# Altium schematic sheet microcontroller.SchDoc: Microcontroller, Indicator, and RX
size Letter; Organization: PulseOut COVID; Address1: By: C. Miller; Address2: pulseoutcovid.com; DocumentNumber: 1; Revision: 0; SheetNumber: 2; SheetTotal: 5
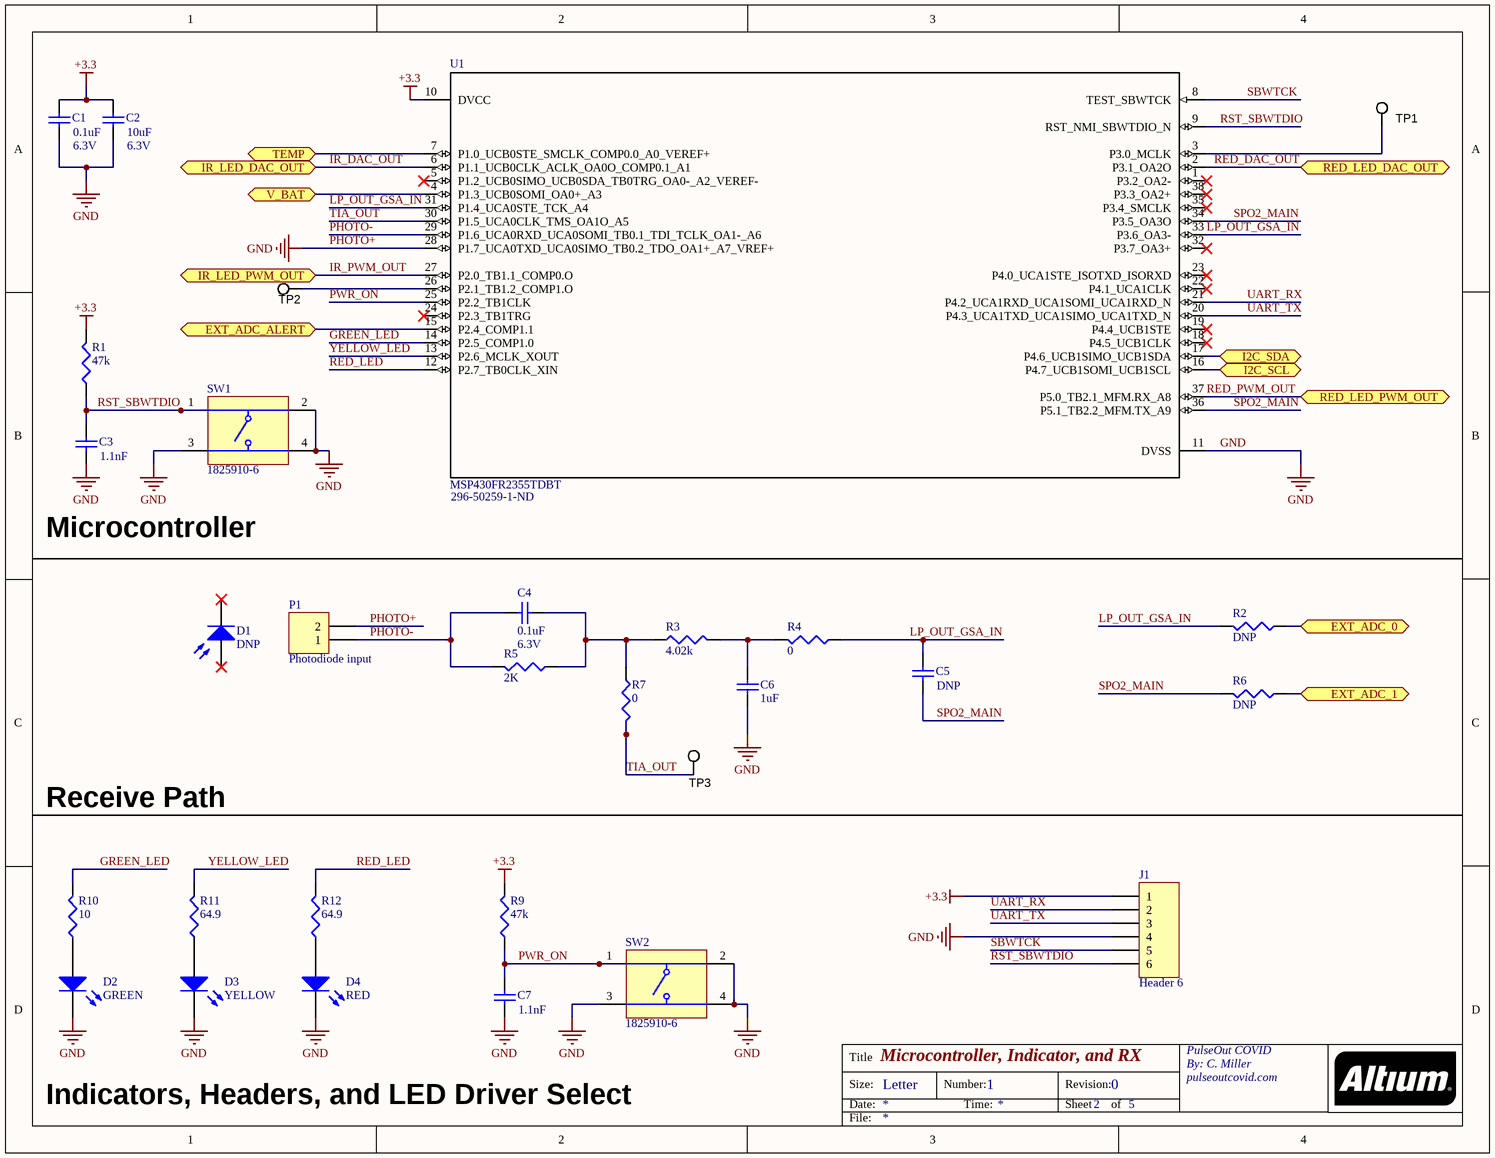
[diagram p0: microcontroller.SchDoc]

## Parts
C1  value 0.1uF  Voltage: 6.3V  [1608[0603]]  (hidden comment: Cap Semi)
C2  value 10uF  Voltage: 6.3V  [1608[0603]]  (hidden comment: Cap Semi)
C3  value 1.1nF  [0603]  (hidden comment: Cap Semi)
C4  value 0.1uF  Voltage: 6.3V  [1608[0603]]  (hidden comment: Cap Semi)
C5  value DNP  [0603]  (hidden comment: Cap Semi)
C6  value 1uF  [1608[0603]]  (hidden comment: Cap Semi)
C7  value 1.1nF  [0603]  (hidden comment: Cap Semi)
D1  DNP  [PIN2]
D2  GREEN  [3.5X2.8X1.9]
D3  YELLOW  [3.5X2.8X1.9]
D4  RED  [3.5X2.8X1.9]
J1  Header 6  [HDR1X6]
P1  Photodiode input  [HDR1X2]
R1  value 47k  [J1-0603]  (hidden comment: Res3)
R2  value DNP  [J1-0603]  (hidden comment: Res3)
R3  value 4.02k  [J1-0603]  (hidden comment: Res3)
R4  value 0  [J1-0603]  (hidden comment: Res3)
R5  value 2K  [J1-0603]  (hidden comment: Res3)
R6  value DNP  [J1-0603]  (hidden comment: Res3)
R7  value 0  [J1-0603]  (hidden comment: Res3)
R9  value 47k  [J1-0603]  (hidden comment: Res3)
R10  value 10  [J1-0603]  (hidden comment: Res3)
R11  value 64.9  [J1-0603]  (hidden comment: Res3)
R12  value 64.9  [J1-0603]  (hidden comment: Res3)
SW1  1825910-6  [TECO-1825910-6_V]
SW2  1825910-6  [TECO-1825910-6_V]
TP1  5002  [Keystone5002]  (value not drawn)
TP2  5002  [Keystone5002]  (value not drawn)
TP3  5002  [Keystone5002]  (value not drawn)
U1  MSP430FR2355TDBT  DigiKey: 296-50259-1-ND  [DBT0038A_N]

## Ports
EXT_ADC_0 (bidir), EXT_ADC_1 (bidir), EXT_ADC_ALERT (bidir), I2C_SCL (bidir), I2C_SDA (bidir), IR_LED_DAC_OUT (bidir), IR_LED_PWM_OUT (bidir), RED_LED_DAC_OUT (bidir), RED_LED_PWM_OUT (bidir), TEMP (bidir), V_BAT (bidir)

## Nets
+3.3: C1.2 C2.2 J1.1 R1.2 R9.2 U1.10(DVCC)
GND: C1.1 C2.1 C3.1 C6.2 C7.1 D2.2(K) D3.2(K) D4.2(K) J1.4 P1.2 SW1.2 SW1.3 SW1.4 SW2.2 SW2.3 SW2.4 U1.11(DVSS) U1.28(P1.7_UCA0TXD_UCA0SIMO_TB0.2_TDO_OA1+_A7_VREF+)  [also labelled PHOTO+]
EXT_ADC_0: R2.1 ; port EXT_ADC_0
EXT_ADC_1: R6.1 ; port EXT_ADC_1
EXT_ADC_ALERT: U1.15(P2.4_COMP1.1) ; port EXT_ADC_ALERT
GREEN_LED: R10.2 U1.14(P2.5_COMP1.0)
I2C_SCL: U1.16(P4.7_UCB1SOMI_UCB1SCL) ; port I2C_SCL
I2C_SDA: U1.17(P4.6_UCB1SIMO_UCB1SDA) ; port I2C_SDA
IR_DAC_OUT: U1.6(P1.1_UCB0CLK_ACLK_OA0O_COMP0.1_A1) ; port IR_LED_DAC_OUT
IR_PWM_OUT: U1.27(P2.0_TB1.1_COMP0.O) ; port IR_LED_PWM_OUT
LP_OUT_GSA_IN: C5.2 R2.2 R4.1 U1.31(P1.4_UCA0STE_TCK_A4) U1.33(P3.6_OA3-)
PHOTO-: C4.2 P1.1 R5.2 U1.29(P1.6_UCA0RXD_UCA0SOMI_TB0.1_TDI_TCLK_OA1-_A6)
PWR_ON: C7.2 R9.1 SW2.1 U1.25(P2.2_TB1CLK)
RED_DAC_OUT: U1.2(P3.1_OA2O) ; port RED_LED_DAC_OUT
RED_LED: R12.2 U1.12(P2.7_TB0CLK_XIN)
RED_PWM_OUT: U1.37(P5.0_TB2.1_MFM.RX_A8) ; port RED_LED_PWM_OUT
RST_SBWTDIO: C3.2 J1.6 R1.1 SW1.1 U1.9(RST_NMI_SBWTDIO_N)
SBWTCK: J1.5 U1.8(TEST_SBWTCK)
SPO2_MAIN: C5.1 R6.2 U1.34(P3.5_OA3O) U1.36(P5.1_TB2.2_MFM.TX_A9)
TEMP: U1.7(P1.0_UCB0STE_SMCLK_COMP0.0_A0_VEREF+) ; port TEMP
TIA_OUT: R7.2 TP3.1 U1.30(P1.5_UCA0CLK_TMS_OA1O_A5)
UART_RX: J1.2 U1.21(P4.2_UCA1RXD_UCA1SOMI_UCA1RXD_N)
UART_TX: J1.3 U1.20(P4.3_UCA1TXD_UCA1SIMO_UCA1TXD_N)
V_BAT: U1.4(P1.3_UCB0SOMI_OA0+_A3) ; port V_BAT
YELLOW_LED: R11.2 U1.13(P2.6_MCLK_XOUT)
NetC4_1: C4.1 R3.1 R5.1 R7.1
NetC6_1: C6.1 R3.2 R4.2
NetD2_1: D2.1(A) R10.1
NetD3_1: D3.1(A) R11.1
NetD4_1: D4.1(A) R12.1
NetTP1_1: TP1.1 U1.3(P3.0_MCLK)
NetTP2_1: TP2.1 U1.26(P2.1_TB1.2_COMP1.O)

Not connected (* = marked no-connect by the designer): D1 1(A)* 2(K)*; U1 1(P3.2_OA2-)* 5(P1.2_UCB0SIMO_UCB0SDA_TB0TRG_OA0-_A2_VEREF-)* 18(P4.5_UCB1CLK)* 19(P4.4_UCB1STE)* 22(P4.1_UCA1CLK)* 23(P4.0_UCA1STE_ISOTXD_ISORXD)* 24(P2.3_TB1TRG)* 32(P3.7_OA3+)* 35(P3.4_SMCLK)* 38(P3.3_OA2+)*

## Notes on the sheet
- Microcontroller
- Receive Path
- Indicators, Headers, and LED Driver Select
- Title
- Size:
- Date:
- Letter
- Number:
- Time:
- Revision:
- Sheet
- of
- File:

## Library data of the parts
C1 C4 = Cap Semi: Capacitor (Semiconductor SIM Model); MPN: 06036C104KAT4A; Manufacturer: AVX Corporation; Published: 8-Jun-2000; LatestRevisionDate: 29-May-2009; LatestRevisionNote: IPC-7351 Footprint Added.; PackageReference: C1206; Publisher: Altium Limited; PackageDescription: Chip Capacitor; DigiKey: 478-06036C104KAT4ACT-ND
C2 = Cap Semi: Capacitor (Semiconductor SIM Model); MPN: JMK107ABJ106KA-T; Manufacturer: Taiyo Yuden; Published: 8-Jun-2000; LatestRevisionDate: 29-May-2009; LatestRevisionNote: IPC-7351 Footprint Added.; PackageReference: C1206; Publisher: Altium Limited; PackageDescription: Chip Capacitor; DigiKey: 587-6012-1-ND
C3 C7 = Cap Semi: Capacitor (Semiconductor SIM Model); MPN: GRM1885C1H112JA01D; Manufacturer: Murata Electronics; Published: 8-Jun-2000; LatestRevisionDate: 29-May-2009; LatestRevisionNote: IPC-7351 Footprint Added.; PackageReference: C1206; Publisher: Altium Limited; PackageDescription: Chip Capacitor; DigiKey: 490-1452-1-ND
C5 = Cap Semi: Capacitor (Semiconductor SIM Model); Published: 8-Jun-2000; LatestRevisionDate: 29-May-2009; LatestRevisionNote: IPC-7351 Footprint Added.; PackageReference: C1206; Publisher: Altium Limited; PackageDescription: Chip Capacitor; DigiKey: DNP
C6 = Cap Semi: Capacitor (Semiconductor SIM Model); MPN: C0603X105J9RAC7867; Manufacturer: KEMET; Published: 8-Jun-2000; LatestRevisionDate: 29-May-2009; LatestRevisionNote: IPC-7351 Footprint Added.; PackageReference: C1206; Publisher: Altium Limited; PackageDescription: Chip Capacitor; DigiKey: 399-17700-1-ND
D1 = Photo Sen: Photosensitive Diode; MPN: BPW34; Manufacturer: OSRAM Opto Semiconductors Inc.; Published: 24-Mar-1999; LatestRevisionDate: 17-Jul-2002; LatestRevisionNote: Re-released for DXP Platform.; PackageReference: PIN2; Publisher: Altium Limited; DigiKey: 475-1070-ND
D2 = LED3: Typical BLUE SiC LED; MPN: 150141GS73100; Manufacturer: Wurth Elektronik; Published: 8-Jun-2000; LatestRevisionDate: 17-Dec-2003; LatestRevisionNote: PCB Footprint replaced.; DatasheetVersion: 16-Apr-2002; PackageVersion: 16-Apr-2002; PackageReference: 3.5X2.8X1.9; Publisher: Altium Limited; PackageDescription: SM LED; 2 C-Bend Leads; Body 3.5 x 2.8 x 1.9 mm, inc leads (LxWxH typ); DigiKey: 732-4997-1-ND
D3 = LED3: Typical BLUE SiC LED; MPN: SML-Z14YTT86C; Manufacturer: Rohm Semiconductor; Published: 8-Jun-2000; LatestRevisionDate: 17-Dec-2003; LatestRevisionNote: PCB Footprint replaced.; DatasheetVersion: 16-Apr-2002; PackageVersion: 16-Apr-2002; PackageReference: 3.5X2.8X1.9; Publisher: Altium Limited; PackageDescription: SM LED; 2 C-Bend Leads; Body 3.5 x 2.8 x 1.9 mm, inc leads (LxWxH typ); DigiKey: SML-Z14YTT86CCT-ND
D4 = LED3: Typical BLUE SiC LED; MPN: 150141RS73100; Manufacturer: Wurth Elektronik; Published: 8-Jun-2000; LatestRevisionDate: 17-Dec-2003; LatestRevisionNote: PCB Footprint replaced.; DatasheetVersion: 16-Apr-2002; PackageVersion: 16-Apr-2002; PackageReference: 3.5X2.8X1.9; Publisher: Altium Limited; PackageDescription: SM LED; 2 C-Bend Leads; Body 3.5 x 2.8 x 1.9 mm, inc leads (LxWxH typ); DigiKey: 732-5000-1-ND
J1 = Header 6: Header, 6-Pin; MPN: 800-10-006-10-001000; Manufacturer: Mill-Max Manufacturing; LatestRevisionDate: 17-Jul-2002; LatestRevisionNote: Re-released for DXP Platform.; Publisher: Altium Limited; DigiKey: ED7264-06-ND
P1 = Header 2: Header, 2-Pin; LatestRevisionDate: 17-Jul-2002; LatestRevisionNote: Re-released for DXP Platform.; Publisher: Altium Limited
R1 R9 = Res3: Resistor; MPN: RC0603JR-0747KL; Manufacturer: Yageo; Published: 8-Jun-2000; LatestRevisionDate: 29-May-2009; LatestRevisionNote: IPC-7351 Footprint Added.; PackageReference: J1-0603; Publisher: Altium Limited; PackageDescription: Chip Resistor; DigiKey: 311-47KGRCT-ND
R2 R6 = Res3: Resistor; Published: 8-Jun-2000; LatestRevisionDate: 29-May-2009; LatestRevisionNote: IPC-7351 Footprint Added.; PackageReference: J1-0603; Publisher: Altium Limited; PackageDescription: Chip Resistor; DigiKey: DNP
R3 = Res3: Resistor; MPN: RMCF0603FT4K02; Manufacturer: Stackpole Electronics; Published: 8-Jun-2000; LatestRevisionDate: 29-May-2009; LatestRevisionNote: IPC-7351 Footprint Added.; PackageReference: J1-0603; Publisher: Altium Limited; PackageDescription: Chip Resistor; DigiKey: RMCF0603FT4K02CT-ND
R4 R7 = Res3: Resistor; MPN: RC0603JR-070RL; Manufacturer: Yageo; Published: 8-Jun-2000; LatestRevisionDate: 29-May-2009; LatestRevisionNote: IPC-7351 Footprint Added.; PackageReference: J1-0603; Publisher: Altium Limited; PackageDescription: Chip Resistor; DigiKey: 311-0.0GRCT-ND
R5 = Res3: Resistor; MPN: RC0603FR-072KL; Manufacturer: Yageo; Published: 8-Jun-2000; LatestRevisionDate: 29-May-2009; LatestRevisionNote: IPC-7351 Footprint Added.; PackageReference: J1-0603; Publisher: Altium Limited; PackageDescription: Chip Resistor; DigiKey: 311-2.00KHRCT-ND
R10 = Res3: Resistor; MPN: RC0603FR-0710RL; Manufacturer: Yageo; Published: 8-Jun-2000; LatestRevisionDate: 29-May-2009; LatestRevisionNote: IPC-7351 Footprint Added.; PackageReference: J1-0603; Publisher: Altium Limited; PackageDescription: Chip Resistor; DigiKey: 311-10.0HRCT-ND
R11 R12 = Res3: Resistor; MPN: ERA-3AEB64R9V; Manufacturer: Panasonic; Published: 8-Jun-2000; LatestRevisionDate: 29-May-2009; LatestRevisionNote: IPC-7351 Footprint Added.; PackageReference: J1-0603; Publisher: Altium Limited; PackageDescription: Chip Resistor; DigiKey: P64.9DBCT-ND
SW1 SW2 = CMP-1684-00021-1: Tact Switch, SPST-NO, 0.05 A, -35 to 85 degC, 4-Pin THD, RoHS, Bulk; Manufacturer: TE Connectivity; Maximum Contact Resistance: 100mOhm; Mechanical Life: 100000Cycles; Bushing Type: Unthreaded; Switch Configuration: OFF(ON); Maximum DC Voltage Rating: 24V; Contact Rating @ Voltage: 0.05A@24VDC; Actuator Color: Black; Body Orientation: Straight; Function: MomentaryContact; Illumination: N/R; Actuator Style: RoundButton; Actuator Material: PolybutyleneTerephthalate; Dielectric Strength: 500VAC; Pole Throw Configuration: SPST; Actuator Length: 1.4mm; Product Weight: N/A; Contact Material: CopperAlloy; Housing Material: N/A; Terminal Type: PCPins; Minimum Insulation Resistance: 100MOhm; Package Description: 4-Pin Through Hole Device, Body 5.99 x 5.99 mm, Pitch 6.5 mm; Part No: 1825910-6; Package Reference: THD; Base Material: N/A; Manufacturer URL: http://www.te.com; Contact Plating: Silver; RoHS: Yes; Datasheet Version: Rev. C9; Electrical Life: 100000Cycles; Maximum AC Voltage Rating: N/A; Thread Size: N/R; Operating Temperature: -35to85C; Mounting: ThroughHole; Dimension: 5.99x5mm; Datasheet URL: http://www.te.com/commerce/DocumentDelivery/DDEController?Action=showdoc&DocId=Customer+Drawing%7F1825910%7FC9%7Fpdf%7FEnglish%7FENG_CD_1825910_C9.pdf%7F1825910-6; Family: 1825910; Seal Location: N/A; Seal Description: N/A; Packaging: N/A; DigiKey: 450-1650-ND; MPN: 1825910-6
TP1-TP3 = 5002: Test Point, Miniature, White, TH; Manufacturer: Keystone; CompType: Test Point Loop; U/M: EA; SymbolVersion: 2008-04-04; PartNumber: 5002; PackageReference: White Miniature Testpoint; RoHS: Y; MountType: TH; ComponentLink1Description: Datasheet Link; ComponentLink1URL: http://www.keyelco.com/userAssets/file/M60-2p60.pdf; Value: White; Publisher: Texas Instruments; LatestRevisionDate: 2015-08-25; Supplier 1: Digi-Key; DigiKey: 36-5002-ND; Supplier 2: Newark; Supplier Part Number 2: 82H9632; MPN: 5002
U1 = MSP430FR2355TDBT: MSP430 IC; Manufacturer: Texas Instruments; PartNumber: MSP430FR2355IDBT; MPN: MSP430FR2355TDBTR; RefDes: RefDes; Type: DEV; Value: Value; Copyright: Copyright (C) 2018 Accelerated Designs. All rights reserved; Supplier 1: Digi-Key; Supplier Part Number 1: 296-50259-1-ND